# Altium schematic sheet ADS7924.SchDoc
size A4
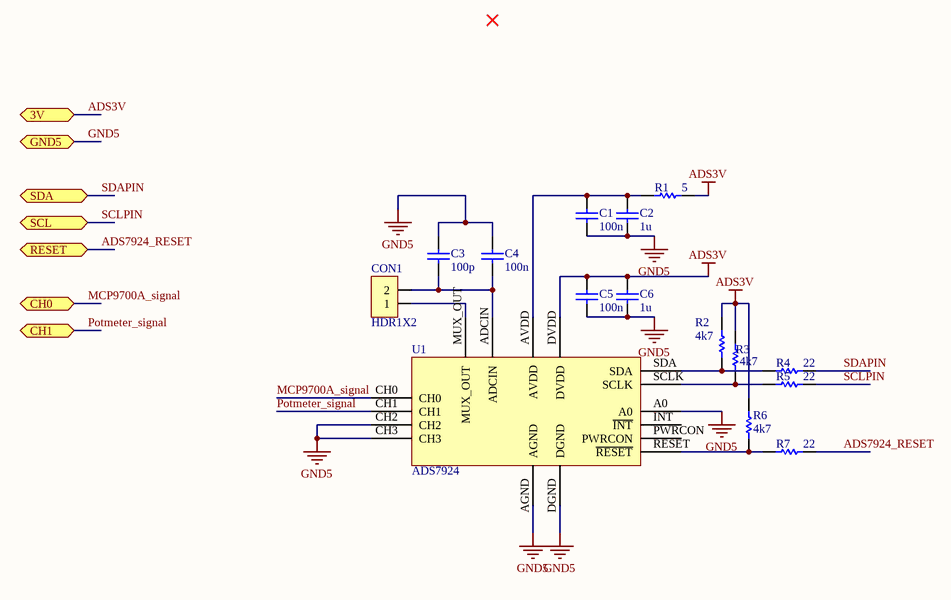
[diagram p0: ADS7924.SchDoc]

## Parts
C1  100n  [0805C]
C2  1u  [0805C]
C3  100p  [0805C]
C4  100n  [0805C]
C5  100n  [0805C]
C6  1u  [0805C]
CON1  HDR1X2  [HDR1X2RAST]
R1  5  [0805R]
R2  4k7  [0805R]
R3  4k7  [0805R]
R4  22  [0805R]
R5  22  [0805R]
R6  4k7  [0805R]
R7  22  [0805R]
U1  ADS7924  [QFN16 - HAND]

## Ports
3V, CH0, CH1, GND5, RESET, SCL, SDA

## Nets
ADS3V: C5.2 C6.2 R1.2 R2.2 R3.2 R6.2 U1.DVDD ; port 3V
GND5: C1.1 C2.1 C3.2 C4.2 C5.1 C6.1 U1.A0 U1.AGND U1.CH2 U1.CH3 U1.DGND ; port GND5
ADS7924_RESET: R7.1 ; port RESET
MCP9700A_signal: U1.CH0 ; port CH0
Potmeter_signal: U1.CH1 ; port CH1
SCLPIN: R5.1 ; port SCL
SDAPIN: R4.1 ; port SDA
NetC1_2: C1.2 C2.2 R1.1 U1.AVDD
NetC3_1: C3.1 C4.1 CON1.2 U1.ADCIN
NetCON1_1: CON1.1 U1.MUX_OUT
NetR2_1: R2.1 R4.2 U1.SDA
NetR3_1: R3.1 R5.2 U1.SCLK
NetR6_1: R6.1 R7.2 U1.RESET(~{RESET})

Not connected (* = marked no-connect by the designer): U1 INT(~{INT}) PWRCON

## Library data of the parts
C1-C6 = CAPACITOR
  C1 C4 C5: Value: 100n
  C2 C6: Value: 1u
  C3: Value: 100p
R1-R7 = RESISTOR
  R1: Value: 5
  R2 R3 R6: Value: 4k7
  R4 R5 R7: Value: 22
U1 = ADS7924: FARNELL: 2496420